# EAGLE design tx (EAGLE 6.5.0)
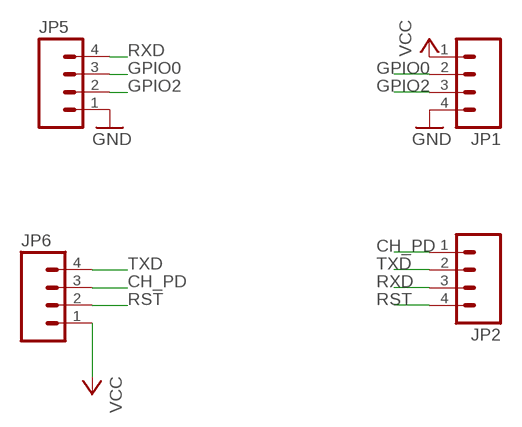
[diagram p0: schematic, sheet 1]

## Parts
JP1  M04PTH  [1X04]
JP2  M04PTH  [1X04]
JP5  M041X04_NO_SILK  [1X04_NO_SILK]
JP6  M041X04_NO_SILK  [1X04_NO_SILK]

## Nets
CH_PD: JP2.1 JP6.3
GND: JP1.4 JP5.1
GPIO0: JP1.2 JP5.3
GPIO2: JP1.3 JP5.2
RST: JP2.4 JP6.2
RXD: JP2.3 JP5.4
TXD: JP2.2 JP6.4
VCC: JP1.1 JP6.1

## Library data of the parts
JP1 JP2 JP5 JP6 = SparkFun-Connectors:M04: Header 4 Standard 4-pin 0.1" header. Use with straight break away headers (SKU : PRT-00116), right angle break away headers (PRT-00553), swiss pins (PRT-00743), machine pins (PRT-00117), and female headers (PRT-00115). Molex polarized connector foot print use with SKU : PRT-08231 with associated crimp pins and housings. 1MM SMD Version SKU: PRT-10208

## Board
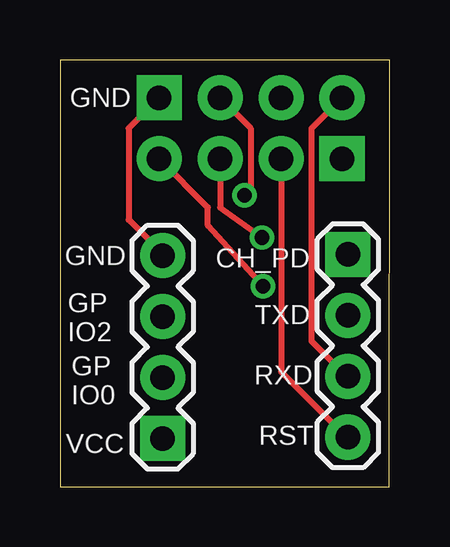
[diagram p1: board, top side]
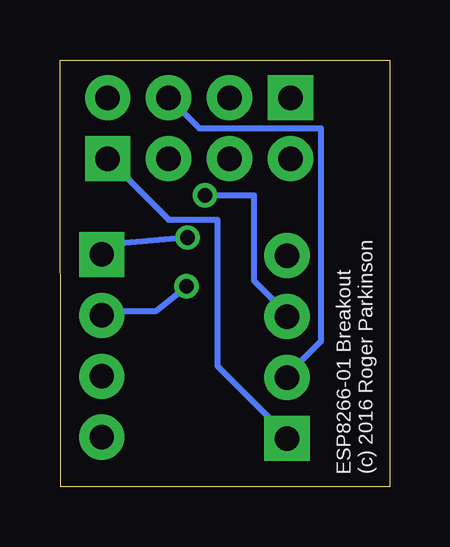
[diagram p2: board, bottom side, seen from below]

Size 13.73 x 17.8 mm. Coordinates in mm from the lower left corner, seen from the top.
Outline: 0.01,0 13.71,0 13.73,17.79 0,17.8 0.01,0
Copper layers (1*16): Top 0.035mm / dielectric 1.5mm / Bottom 0.035mm
Design rules "default": minimum track width 10mil, minimum drill 24mil, track to track 8mil, track to pad 8mil, pad to pad 8mil, via to via 8mil, smd to smd 8mil, copper to edge 40mil, drill to drill 8mil, minimum pad ring 10mil, minimum via ring 8mil, stop-mask expansion 4mil, vias tented up to drill 0mil, thermal gap 10mil

### Footprints (pad centres in the part's own frame; a part is rotated, then mirrored left to right if it is on the bottom)
1X04 = drill 1.016 pad 1.88 square: 1 0,0 | drill 1.016 pad 1.88: 2 2.54,0; 3 5.08,0; 4 7.62,0
1X04_NO_SILK = drill 1.016 pad 1.88 square: 1 0,0 | drill 1.016 pad 1.88: 2 2.54,0; 3 5.08,0; 4 7.62,0

### Placement (x,y rotation side)
JP1  4.27,2.01 90 top
JP2  12,9.69 270 top
JP5  4.13,16.22 0 top
JP6  11.75,13.68 180 top

### Tracks (layer width: path | path; a pad name or v marks a point on that pad's centre or on a via)
CH_PD  (via drill 0.61)
  Top 0.254: v8.42,10.39 6.67,11.65 JP6.3
  Bottom 0.254: v8.42,10.39 11.5,10.12 11.75,9.87 JP2.1
GND
  Top 0.254: JP5.1 2.86,14.95 2.86,11.14 4.13,9.87 JP1.4
GPIO0
  Bottom 0.254: JP5.3 7.94,14.95 2.86,14.95 2.86,6.06 4.13,4.79 JP1.2
GPIO2  (via drill 0.61)
  Top 0.254: v7.69,12.16 7.94,12.41 7.94,14.95 JP5.2
  Bottom 0.254: v7.69,12.16 5.66,12.16 5.66,8.6 4.39,7.33 JP1.3
RST
  Top 0.254: JP6.2 9.21,4.79 11.75,2.25 JP2.4
RXD
  Top 0.254: JP5.4 10.48,14.95 10.48,6.06 11.75,4.79 JP2.3
TXD  (via drill 0.61)
  Top 0.254: JP6.4 6.16,11.65 6.16,10.89 v8.46,8.36
  Bottom 0.254: v8.46,8.36 9.72,7.33 11.75,7.33 JP2.2
VCC
  Bottom 0.254: JP6.1 9.21,11.14 7.18,11.14 7.18,5.04 4.39,2.25 JP1.1

### Text on the board
tPlace: GND | GND | CH_PD | TXD | GP / IO2 | RXD | GP / IO0 | RST | VCC
_bsilk: ESP8266-01 Breakout / (c) 2016 Roger Parkinson